# EAGLE design gas_sensor_childboard_v1 (EAGLE 6.5.0)
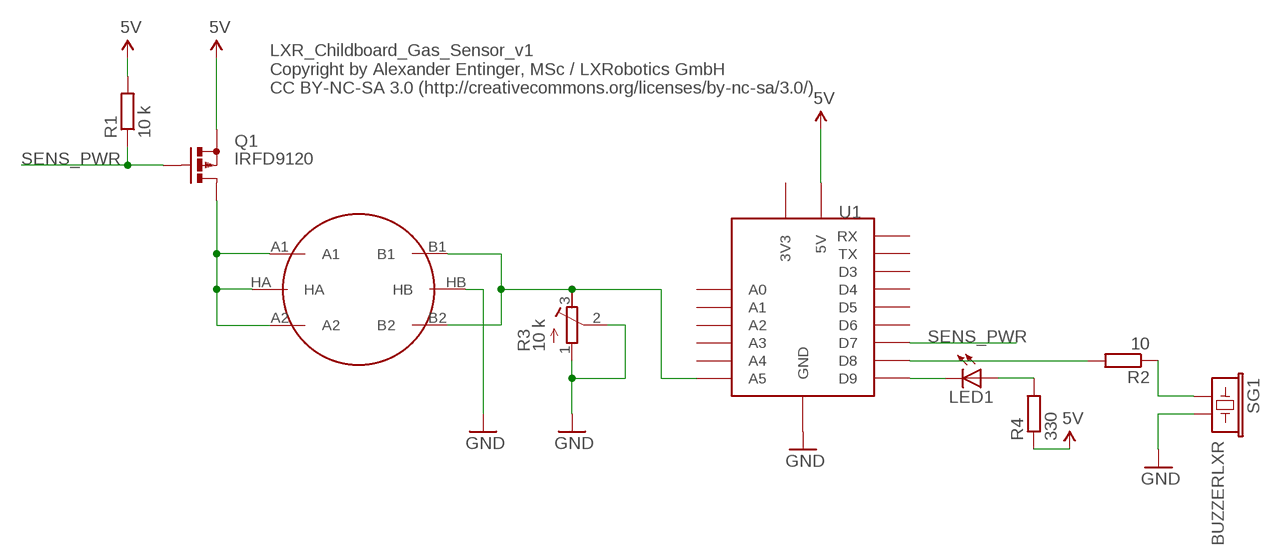
[diagram p0: schematic, sheet 1]

## Parts
LED1  5 mm RED  LED5MM  [LED5MM]
MQ-2  METHANE_SENSOR  [MQ-3]
Q1  IRFD9120  [C370-01]
R1  10 k  R-EU_0207/7  [0207/7]
R2  10  R-EU_0207/7  [0207/7]
R3  10 k  R-TRIMM3339P  [RTRIM3339P]
R4  330  R-EU_0207/7  [0207/7]
SG1  BUZZERLXR  [BUZZER_LXR]
U1  RF_CHILDBOARD_CONRF_C  [RF_CHILDBOARD_CON]

## Nets
5V: Q1.S R1.2 R4.1 U1.5V
GND: MQ-2.HB R3.1(E) R3.2(S) SG1.2 U1.GND U1.GND1(GND) U1.GND2(GND)
N$1: MQ-2.A1 MQ-2.A2 MQ-2.HA Q1.D Q1.D1(D)
N$2: MQ-2.B1 MQ-2.B2 R3.3(A) U1.A5
N$3: R2.1 SG1.1
N$4: R2.2 U1.D8
N$5: LED1.A R4.2
N$6: LED1.K(C) U1.D9
SENS_PWR: Q1.G R1.1 U1.D7
Unconnected: U1.3V3 U1.A0 U1.A1 U1.A2 U1.A3 U1.A4 U1.D3 U1.D4 U1.D5 U1.D6 U1.RX U1.TX

## Notes on the sheet
- LXR_Childboard_Gas_Sensor_v1
  Copyright by Alexander Entinger, MSc / LXRobotics GmbH
  CC BY-NC-SA 3.0 (http://creativecommons.org/licenses/by-nc-sa/3.0/)

## Library data of the parts
LED1 = SparkFun-LED:LED: LEDs Standard schematic elements and footprints for 5mm, 3mm, 1206, and 0603 sized LEDs. 5mm - Spark Fun Electronics SKU : COM-00529 (and others)
MQ-2 = SparkFun-Sensors:METHANE_SENSOR: MQ-4 Methane Gas Sensor SEN-09404
Q1 = transistor-small-signal:IRFD9120: P-CHANNEL MOS FET
R1 R2 R4 = resistor:R-EU_: RESISTOR, European symbol
R3 = resistor:R-TRIMM: Trimm resistor
SG1 = SparkFun-Electromechanical:BUZZER: Buzzer 12mm Spark Fun Electronics SKU : Comp-Buzzer
U1 = lxrobotics:RF_CHILDBOARD_CON

## Board
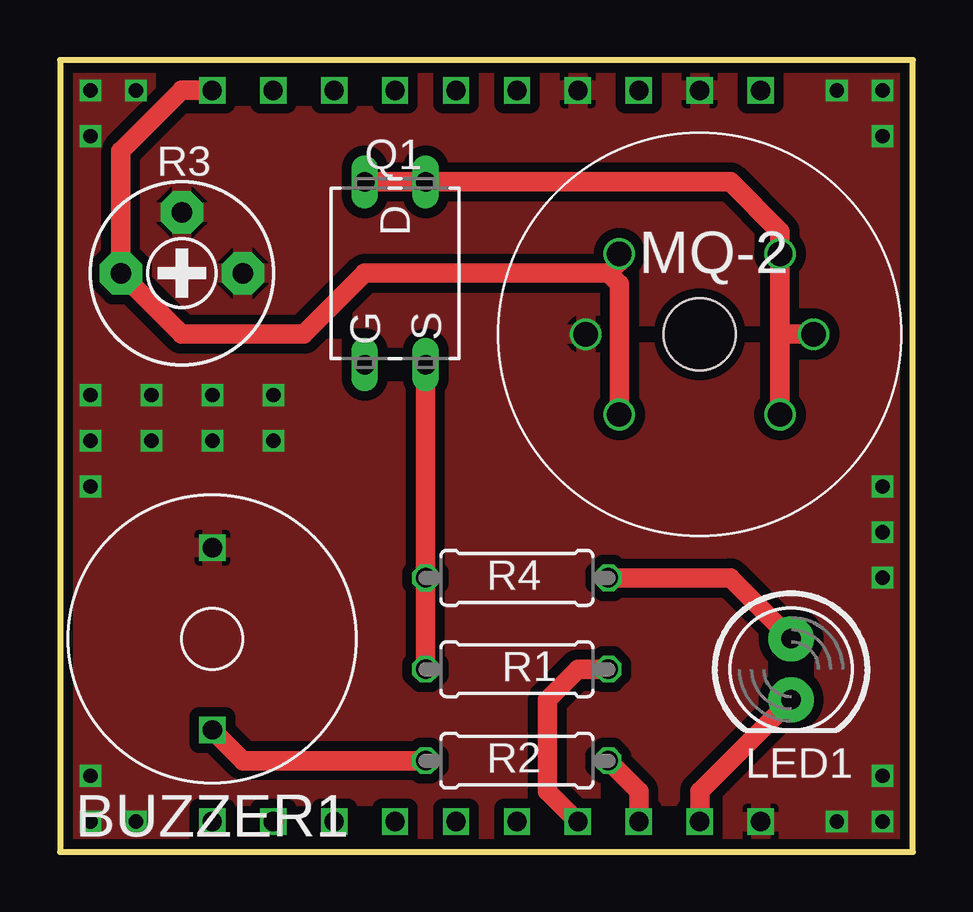
[diagram p1: board, top side]
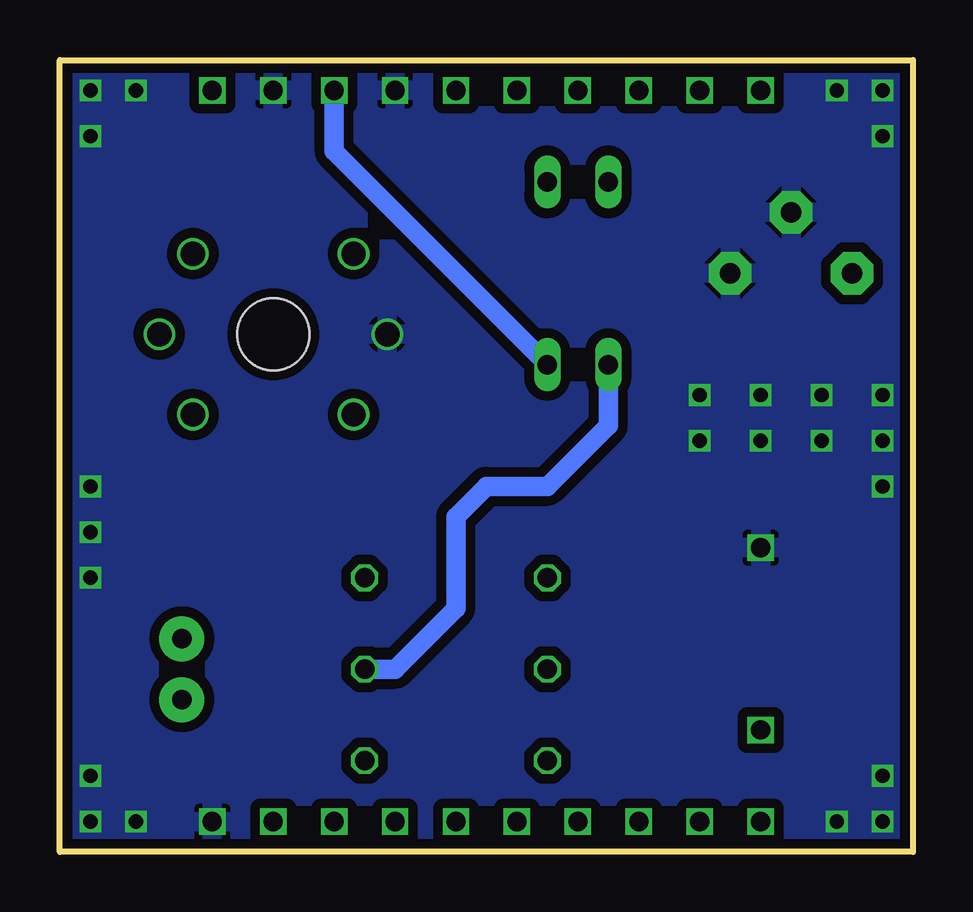
[diagram p2: board, bottom side, seen from below]

Size 35.56 x 33.02 mm. Coordinates in mm from the lower left corner, seen from the top.
Outline: 0,0 35.56,0 35.56,33.02 0,33.02 0,0
Copper layers (1*16): Top 0.035mm / dielectric 1.5mm / Bottom 0.035mm
Design rules "LeitOn - Standard-Eagle-DRU - 1- und  2-Lagen DK - deutsch - Rev 2.0": minimum track width 0.15mm, minimum drill 0.3mm, track to track 0.15mm, track to pad 0.15mm, pad to pad 0.15mm, via to via 0.15mm, smd to smd 0.15mm, copper to edge 0.3mm, drill to drill 0.3mm, minimum pad ring 0.15mm, minimum via ring 0.15mm, stop-mask expansion 0.075mm, vias tented up to drill 0mil, thermal gap 0.2mm

### Footprints (pad centres in the part's own frame; a part is rotated, then mirrored left to right if it is on the bottom)
LED5MM = drill 0.813 pad 1.88: A -1.27,0; K 1.27,0
MQ-3 = drill 1.016: A1 -3.35,3.35; A2 -3.35,-3.35; B1 3.35,3.35; B2 3.35,-3.35; HA -4.75,0; HB 4.75,0 | hole 3: 0,0
C370-01 = drill 0.813 long: D -3.81,1.27; D1 -3.81,-1.27; G 3.81,-1.27; S 3.81,1.27
0207/7 = drill 0.813 octagon: 1 -3.81,0; 2 3.81,0
RTRIM3339P = drill 0.85 pad 1.778 octagon: 1 -2.54,0; 2 0,-2.54; 3 2.54,0
BUZZER_LXR = drill 0.8 square: 1 -3.8,0; 2 3.8,0
RF_CHILDBOARD_CON = drill 0.8 square: 3V3 12.7,30.48; 5V 7.62,30.48; A0 2.54,30.48; A1 0,30.48; A2 -2.54,30.48; A3 -5.08,30.48; A4 -7.62,30.48; A5 -10.16,30.48; D3 -5.08,0; D4 -2.54,0; D5 0,0; D6 2.54,0; D7 5.08,0; D8 7.62,0; D9 10.16,0; GND 5.08,30.48; GND1 10.16,30.48; GND2 12.7,0; RX -10.16,0; TX -7.62,0

### Placement (x,y rotation side)
LED1  30.48,7.62 270 top
MQ-2  26.67,21.59 180 top
Q1  13.97,24.13 270 top
R1  19.05,7.62 180 top
R2  19.05,3.81 0 top
R3  5.08,24.13 180 top
R4  19.05,11.43 0 top
SG1  6.35,8.89 90 top
U1  16.51,1.27 0 top

### Tracks (layer width: path | path; a pad name or v marks a point on that pad's centre or on a via)
5V
  Top 0.813: R1.2 R4.1 Q1.S
  Bottom 0.813: Q1.S 24.13,29.21 U1.5V
GND  (via drill 0.6)
  other vias: 1.27,31.75 1.27,29.84 3.17,31.75 32.38,31.75 34.29,31.75 34.29,29.84 34.29,15.24 34.29,13.34 34.29,11.43 34.29,3.18 34.29,1.27 32.38,1.27 3.17,1.27 1.27,1.27 1.27,3.18 1.27,15.24 1.27,17.14 1.27,19.05 3.81,19.05 3.81,17.14 6.35,19.05 6.35,17.14 8.89,19.05 8.89,17.14
  pour Top (isolate 0.406): 0.63,0.63 34.92,0.63 34.92,32.38 0.63,32.38
  pour Bottom (isolate 0.406): 0.63,0.63 34.92,0.63 34.92,32.38 0.63,32.38
N$1
  Top 0.813: Q1.D1 Q1.D 27.94,27.94 30.02,25.86 MQ-2.A2 30.02,21.59 | MQ-2.A1 30.02,21.59 | MQ-2.HA 30.02,21.59
N$2
  Top 0.813: 22.86,24.13 12.7,24.13 10.16,21.59 5.08,21.59 R3.3 2.54,29.21 5.08,31.75 U1.A5 | 22.86,24.13 23.32,23.67 MQ-2.B1 | 22.86,24.13 23.32,24.59 MQ-2.B2
N$3
  Top 0.813: R2.1 7.63,3.81 SG1.1
N$4
  Top 0.813: U1.D8 24.13,2.54 R2.2
N$5
  Top 0.813: R4.2 27.94,11.43 LED1.A
N$6
  Top 0.813: U1.D9 26.67,2.54 LED1.K
SENS_PWR
  Top 0.813: U1.D7 20.32,2.54 20.32,6.35 21.59,7.62 R1.1
  Bottom 0.813: R1.1 21.59,7.62 19.05,10.16 19.05,13.97 17.78,15.24 15.24,15.24 12.7,17.78 Q1.G

### Text on the board
tNames: MQ-2 | BUZZER1